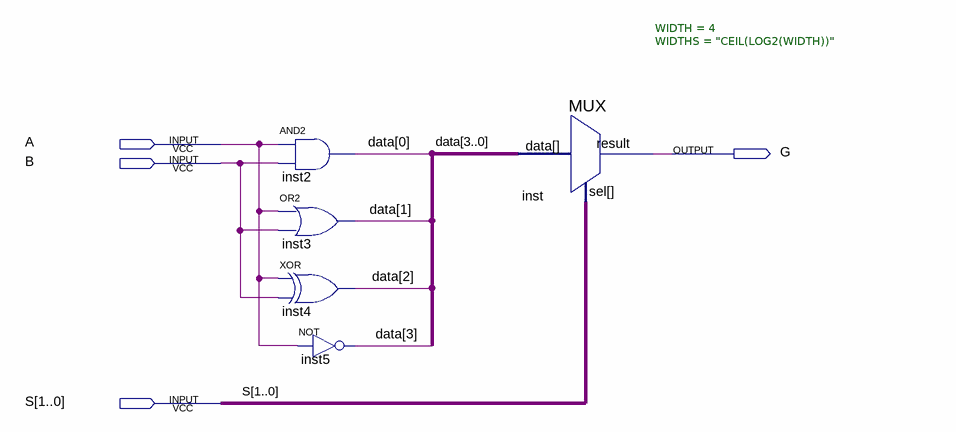
[diagram p0: schematic sheet]
// Quartus schematic Logic_Circuit.bdf as structural Verilog: 5 symbols, 4 pins
module Logic_Circuit (
  input  A,
  input  B,
  input  [1:0] S,
  output G
);

  wire [3:0] data;

  and inst2 (data[0], A, B);
  or inst3 (data[1], A, B);
  xor inst4 (data[2], A, B);
  not inst5 (data[3], A);
  MUX #(.WIDTH(4), .WIDTHS("CEIL(LOG2(WIDTH))")) inst (.data(data), .sel(S), .result(G));
endmodule
